# Altium schematic sheet temp.SchDoc
size A4
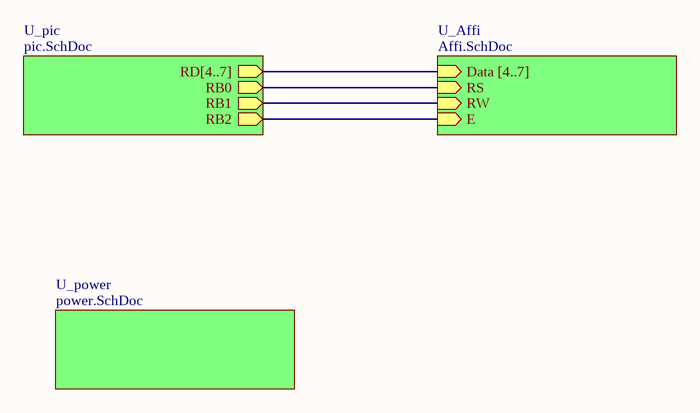
[diagram p0: temp.SchDoc]

## Sub-sheets
U_Affi = Affi.SchDoc: RS (in), RW (in), E (in), Data [4..7] (in)
U_pic = pic.SchDoc: RD[4..7] (out), RB0 (out), RB1 (out), RB2 (out)
U_power = power.SchDoc: no entries

## Nets
(unnamed): sheet U_pic/RB0, sheet U_Affi/RS
(unnamed): sheet U_pic/RB1, sheet U_Affi/RW
(unnamed): sheet U_pic/RB2, sheet U_Affi/E

## Buses and harness runs
bus sheet U_Affi/Data [4..7] = sheet U_pic/RD[4..7]